# EasyEDA Pro project wireless charger receiver.eprj, schematic Schematic3
Board Name: PCB3; Create Date: 2025-05-17; Page Name: P1; Project Name: wireless charger receiver; Schematic Name: Schematic3; Update Date: 2025-05-17; Company: 嘉立创EDA; Page Size: A4; Version: V1.0
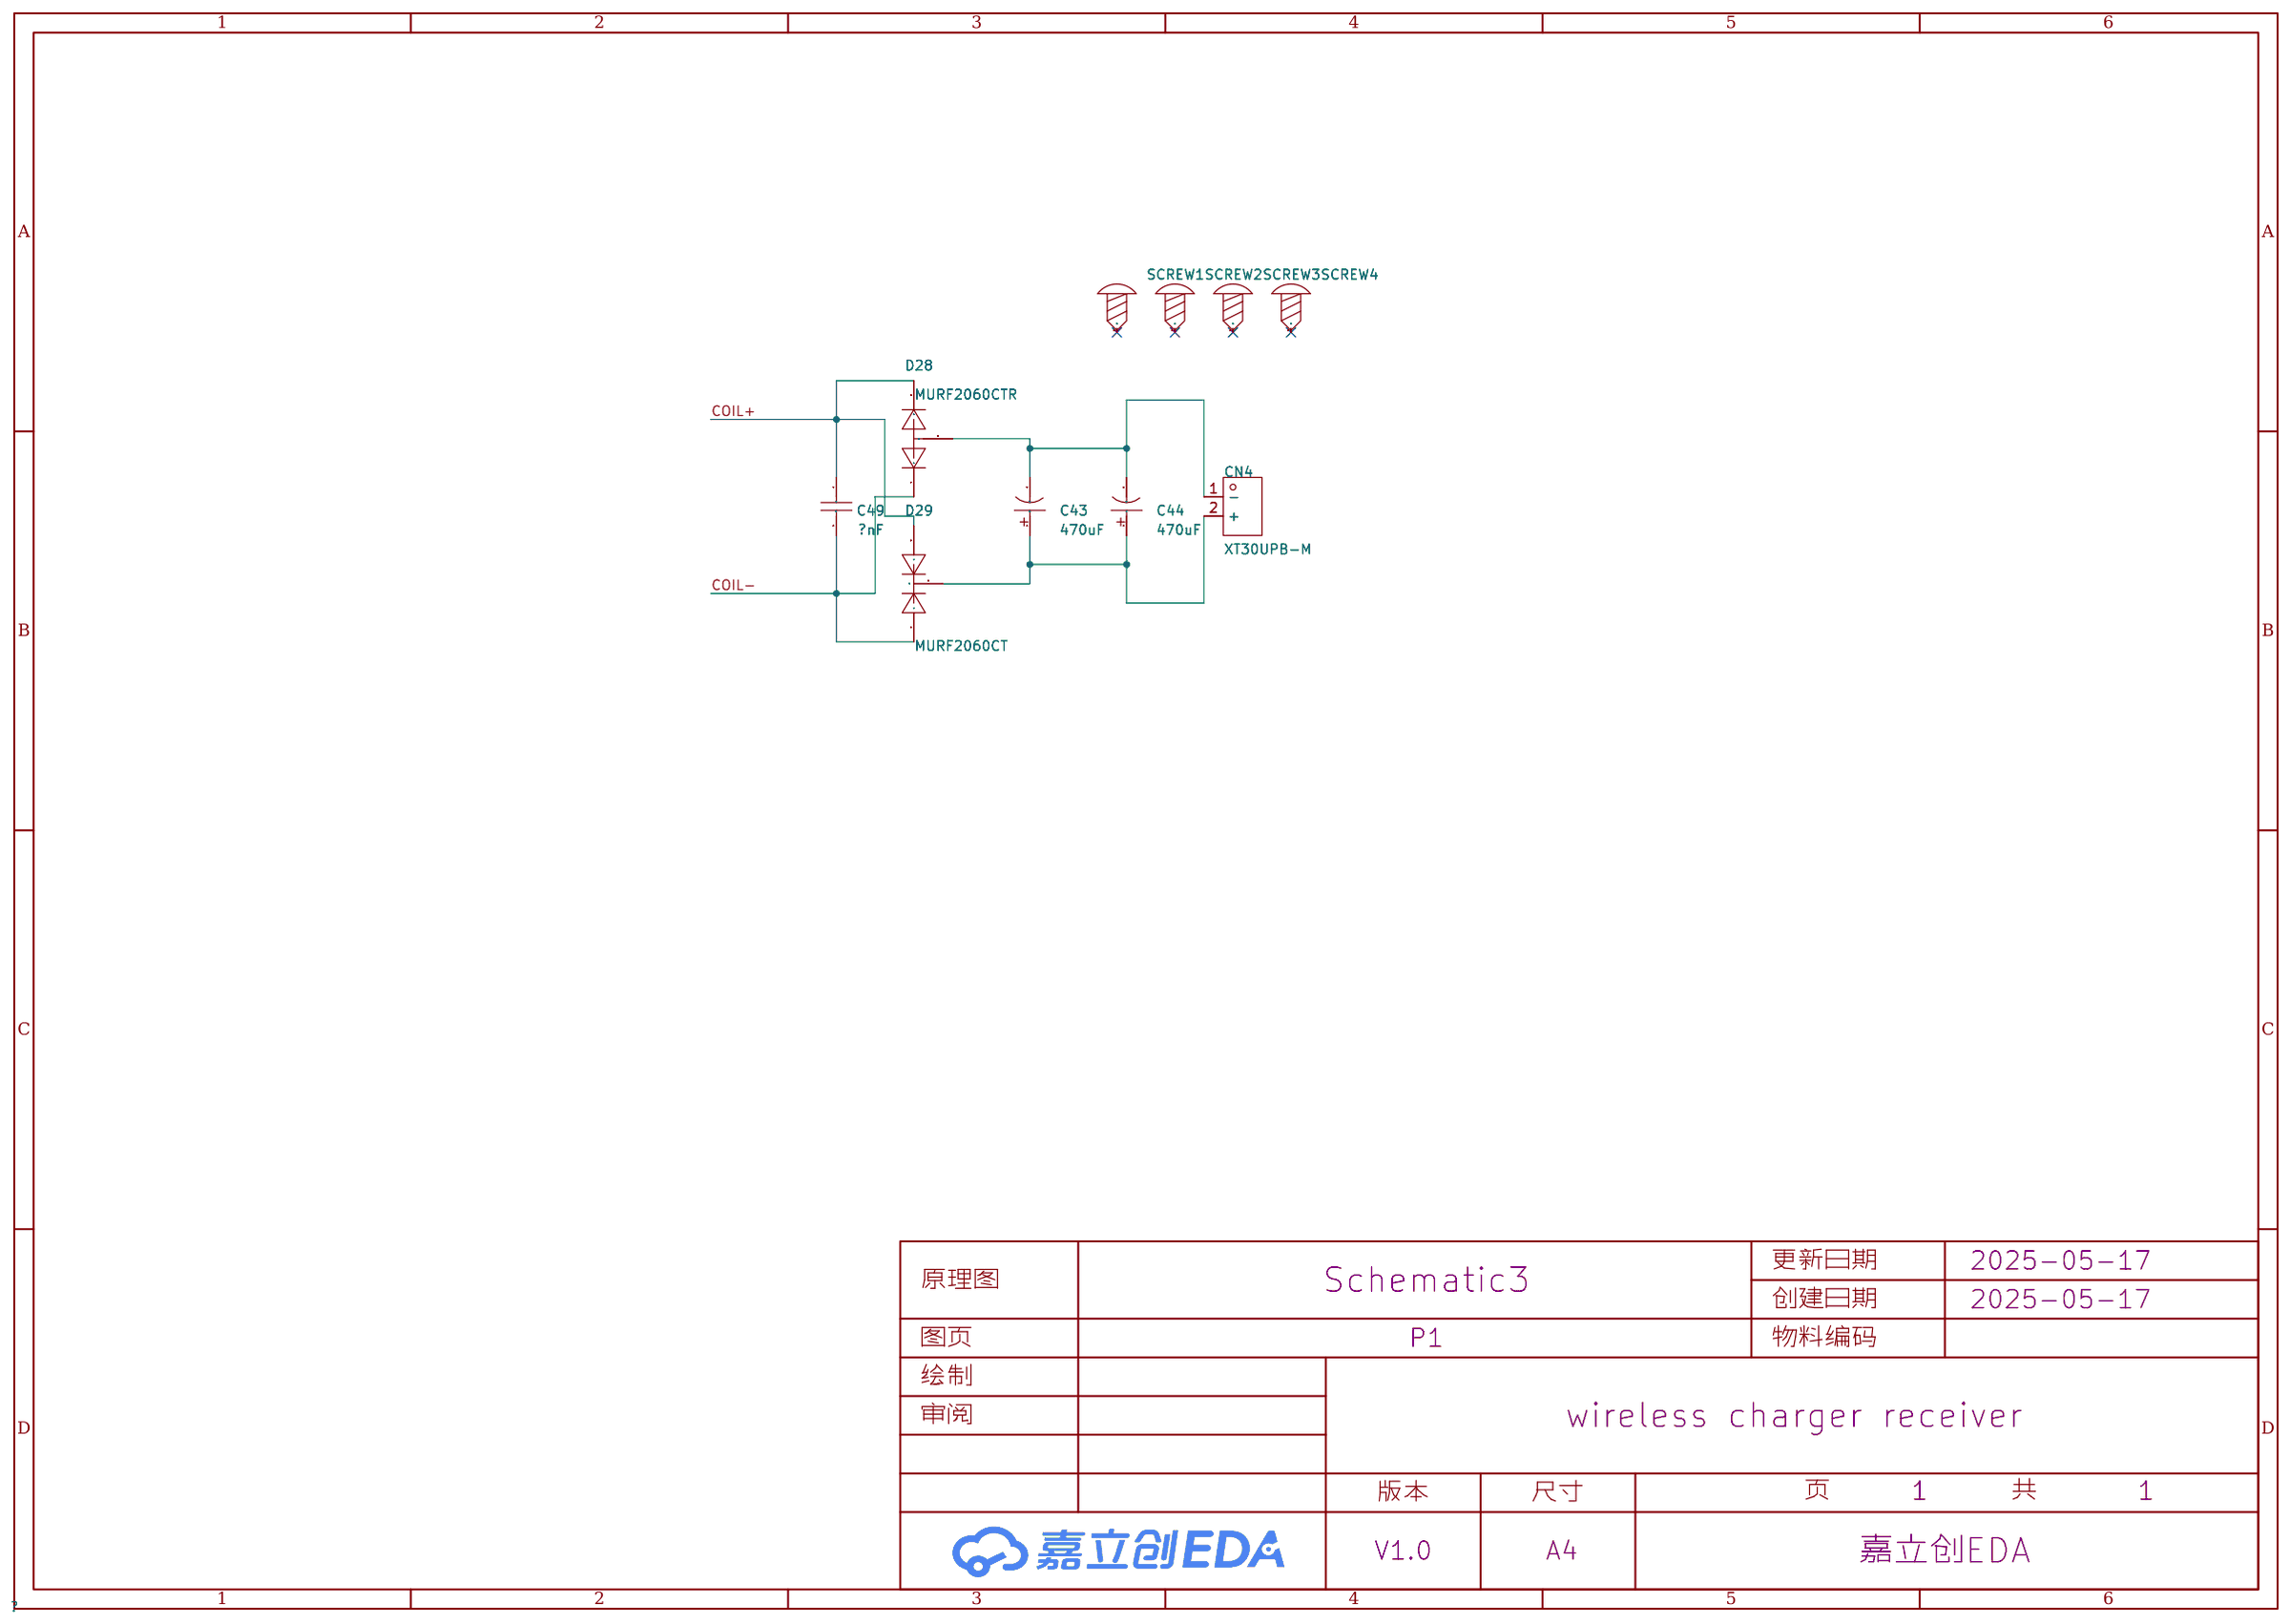
[diagram p2: schematic sheet]

## Parts
C43  470uF  [CAP-TH_BD16.0-P7.50-D1.2-FD]
C44  470uF  [CAP-TH_BD16.0-P7.50-D1.2-FD]
C49  ？nF  [C1206]
CN4  XT30UPB-M  [CONN-TH_XT30UPB-M]
D28  MURF2060CTR  [TO-220F-3_L10.2-W4.7-P2.54-L]
D29  MURF2060CT  [TO-220-3_L9.9-W4.5-P2.54-L-1]
SCREW1  -  [M3螺丝]
SCREW2  -  [M3螺丝]
SCREW3  -  [M3螺丝]
SCREW4  -  [M3螺丝]

## Library data of the parts
C43 C44 = EWH1KM471L25OT: LCSC Part Name: 470uF ±20% 100V; Supplier Part: C106743; Manufacturer: AISHI(艾华集团); Supplier Footprint: 插件,D16xL25mm; JLCPCB Part Class: 扩展库; Datasheet: https://atta.szlcsc.com/upload/public/pdf/source/20200106/C481308_16D735F9103482ADD8491C667D201AFA.pdf; Supplier: LCSC; Tolerance: ±20%; Voltage Rating: 100V; Pin Spacing: 7.5mm; Diameter: 16mm; Height - Seated (Max): 25mm; Lifetime: 2000hrs@105℃
C49 = GRM31C5C1H104JA01L: LCSC Part Name: 100nF ±5% 50V; Supplier Part: C97946; Manufacturer: muRata(村田); Supplier Footprint: 1206; JLCPCB Part Class: 扩展库; Datasheet: https://atta.szlcsc.com/upload/public/pdf/source/20180228/C97946_15198056954501377706.pdf; Supplier: LCSC; Tolerance: ±5%; Voltage Rated: 50V; Temperature Coefficient: C0G
CN4 = XT30UPB-M: LCSC Part Name: AMASS(艾迈斯)板载立式 航模锂电池控制器连接器插头 公头XT30UPB-M; Supplier Part: C428721; Manufacturer: AMASS(艾迈斯); JLCPCB Part Class: Extended Part; Datasheet: https://atta.szlcsc.com/upload/public/pdf/source/20230412/7B5DFEF57C9EA5273853390C734B3AC5.pdf; Supplier: LCSC; Brand: 艾迈斯; Type: 航模插头; Colour: 黄色; RatedVoltage: DC 500V; InterfaceType: 公头; MetalMaterial: 镀金; InsulationMaterial: PA; RatedCurrent: 15A; contact resistance: 0.65mΩ
D28 = MURF2060CTR: Supplier Part: C22369112; Manufacturer: Wild Goose(威谷); Supplier Footprint: TO-220F; JLCPCB Part Class: 扩展库; Datasheet: https://atta.szlcsc.com/upload/public/pdf/source/20240521/F4D93C48CB68240D2A58F11026AF4A0F.pdf; Supplier: LCSC
D29 = MURF2060CT_C34373784: Supplier Part: C34373784; Manufacturer: OSEN(欧芯); Supplier Footprint: TO-220F; Datasheet: https://atta.szlcsc.com/upload/public/pdf/source/20240729/28211828F9CA7ECC5F1302E22622FCA3.pdf; Supplier: LCSC
SCREW1-SCREW4 = M3螺丝: Supplier Footprint: 插件

## Nets
COIL+: C49.1 D28.3 D29.3(A)
COIL-: C49.2 D28.1 D29.1(A)
$1N378: C43.2 C44.2 CN4.1(-) D28.2
$1N380: C43.1 C44.1 CN4.2(+) D29.2

Not connected (* = marked no-connect by the designer): SCREW1 1*; SCREW2 1*; SCREW3 1*; SCREW4 1*
